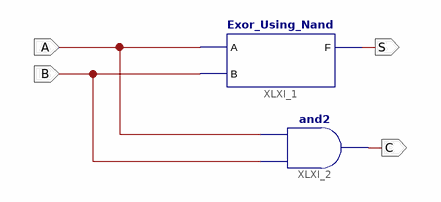
[diagram p0: schematic sheet 1]
// Xilinx ISE schematic Half_Adder.sch (spartan3e) as structural Verilog: 2 symbols, 4 ports
module Half_Adder (
  input  A,
  input  B,
  output S,
  output C
);

  Exor_Using_Nand XLXI_1 (.A(A), .B(B), .F(S));
  and XLXI_2 (C, B, A);
endmodule
